# Altium schematic sheet Insole_ver1_chi.SchDoc
size 594 x 420 mm; SheetNumber: 1; SheetTotal: 1
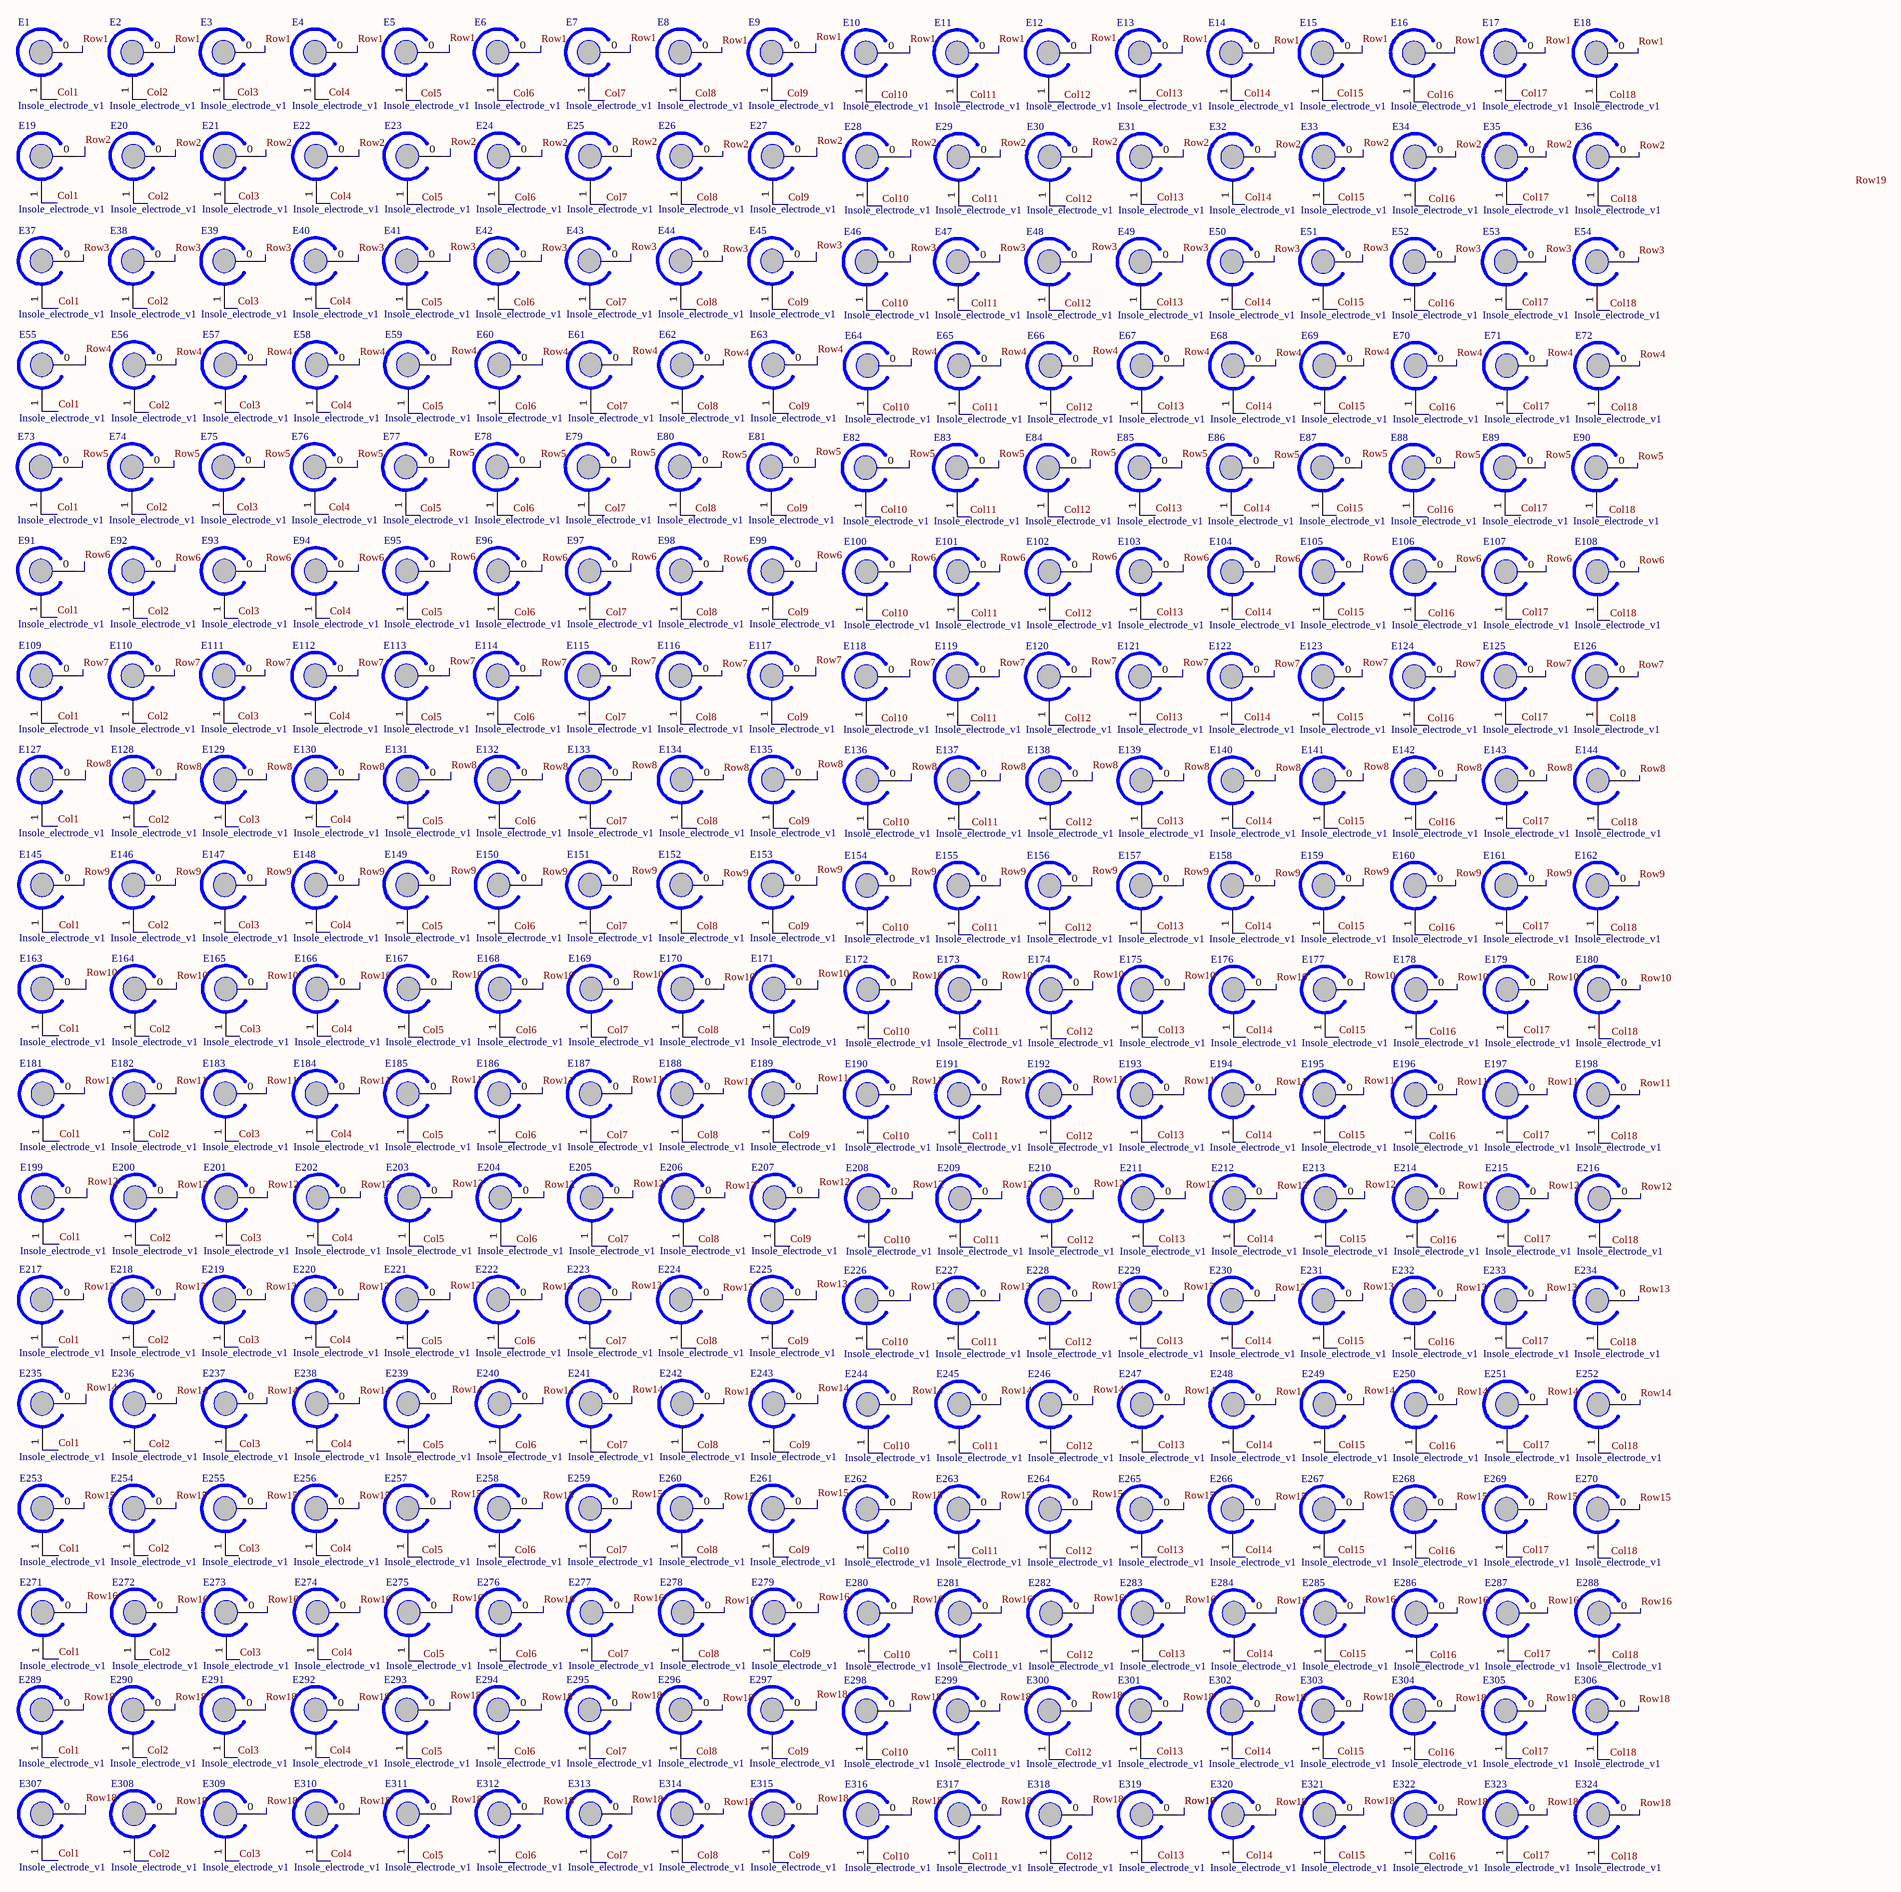
[diagram p0: Insole_ver1_chi.SchDoc]

## Parts
E1  Insole_electrode_v1  [insole_electrode_v1]
E2  Insole_electrode_v1  [insole_electrode_v1]
E3  Insole_electrode_v1  [insole_electrode_v1]
E4  Insole_electrode_v1  [insole_electrode_v1]
E5  Insole_electrode_v1  [insole_electrode_v1]
E6  Insole_electrode_v1  [insole_electrode_v1]
E7  Insole_electrode_v1  [insole_electrode_v1]
E8  Insole_electrode_v1  [insole_electrode_v1]
E9  Insole_electrode_v1  [insole_electrode_v1]
E10  Insole_electrode_v1  [insole_electrode_v1]
E11  Insole_electrode_v1  [insole_electrode_v1]
E12  Insole_electrode_v1  [insole_electrode_v1]
E13  Insole_electrode_v1  [insole_electrode_v1]
E14  Insole_electrode_v1  [insole_electrode_v1]
E15  Insole_electrode_v1  [insole_electrode_v1]
E16  Insole_electrode_v1  [insole_electrode_v1]
E17  Insole_electrode_v1  [insole_electrode_v1]
E18  Insole_electrode_v1  [insole_electrode_v1]
E19  Insole_electrode_v1  [insole_electrode_v1]
E20  Insole_electrode_v1  [insole_electrode_v1]
E21  Insole_electrode_v1  [insole_electrode_v1]
E22  Insole_electrode_v1  [insole_electrode_v1]
E23  Insole_electrode_v1  [insole_electrode_v1]
E24  Insole_electrode_v1  [insole_electrode_v1]
E25  Insole_electrode_v1  [insole_electrode_v1]
E26  Insole_electrode_v1  [insole_electrode_v1]
E27  Insole_electrode_v1  [insole_electrode_v1]
E28  Insole_electrode_v1  [insole_electrode_v1]
E29  Insole_electrode_v1  [insole_electrode_v1]
E30  Insole_electrode_v1  [insole_electrode_v1]
E31  Insole_electrode_v1  [insole_electrode_v1]
E32  Insole_electrode_v1  [insole_electrode_v1]
E33  Insole_electrode_v1  [insole_electrode_v1]
E34  Insole_electrode_v1  [insole_electrode_v1]
E35  Insole_electrode_v1  [insole_electrode_v1]
E36  Insole_electrode_v1  [insole_electrode_v1]
E37  Insole_electrode_v1  [insole_electrode_v1]
E38  Insole_electrode_v1  [insole_electrode_v1]
E39  Insole_electrode_v1  [insole_electrode_v1]
E40  Insole_electrode_v1  [insole_electrode_v1]
E41  Insole_electrode_v1  [insole_electrode_v1]
E42  Insole_electrode_v1  [insole_electrode_v1]
E43  Insole_electrode_v1  [insole_electrode_v1]
E44  Insole_electrode_v1  [insole_electrode_v1]
E45  Insole_electrode_v1  [insole_electrode_v1]
E46  Insole_electrode_v1  [insole_electrode_v1]
E47  Insole_electrode_v1  [insole_electrode_v1]
E48  Insole_electrode_v1  [insole_electrode_v1]
E49  Insole_electrode_v1  [insole_electrode_v1]
E50  Insole_electrode_v1  [insole_electrode_v1]
E51  Insole_electrode_v1  [insole_electrode_v1]
E52  Insole_electrode_v1  [insole_electrode_v1]
E53  Insole_electrode_v1  [insole_electrode_v1]
E54  Insole_electrode_v1  [insole_electrode_v1]
E55  Insole_electrode_v1  [insole_electrode_v1]
E56  Insole_electrode_v1  [insole_electrode_v1]
E57  Insole_electrode_v1  [insole_electrode_v1]
E58  Insole_electrode_v1  [insole_electrode_v1]
E59  Insole_electrode_v1  [insole_electrode_v1]
E60  Insole_electrode_v1  [insole_electrode_v1]
E61  Insole_electrode_v1  [insole_electrode_v1]
E62  Insole_electrode_v1  [insole_electrode_v1]
E63  Insole_electrode_v1  [insole_electrode_v1]
E64  Insole_electrode_v1  [insole_electrode_v1]
E65  Insole_electrode_v1  [insole_electrode_v1]
E66  Insole_electrode_v1  [insole_electrode_v1]
E67  Insole_electrode_v1  [insole_electrode_v1]
E68  Insole_electrode_v1  [insole_electrode_v1]
E69  Insole_electrode_v1  [insole_electrode_v1]
E70  Insole_electrode_v1  [insole_electrode_v1]
E71  Insole_electrode_v1  [insole_electrode_v1]
E72  Insole_electrode_v1  [insole_electrode_v1]
E73  Insole_electrode_v1  [insole_electrode_v1]
E74  Insole_electrode_v1  [insole_electrode_v1]
E75  Insole_electrode_v1  [insole_electrode_v1]
E76  Insole_electrode_v1  [insole_electrode_v1]
E77  Insole_electrode_v1  [insole_electrode_v1]
E78  Insole_electrode_v1  [insole_electrode_v1]
E79  Insole_electrode_v1  [insole_electrode_v1]
E80  Insole_electrode_v1  [insole_electrode_v1]
E81  Insole_electrode_v1  [insole_electrode_v1]
E82  Insole_electrode_v1  [insole_electrode_v1]
E83  Insole_electrode_v1  [insole_electrode_v1]
E84  Insole_electrode_v1  [insole_electrode_v1]
E85  Insole_electrode_v1  [insole_electrode_v1]
E86  Insole_electrode_v1  [insole_electrode_v1]
E87  Insole_electrode_v1  [insole_electrode_v1]
E88  Insole_electrode_v1  [insole_electrode_v1]
E89  Insole_electrode_v1  [insole_electrode_v1]
E90  Insole_electrode_v1  [insole_electrode_v1]
E91  Insole_electrode_v1  [insole_electrode_v1]
E92  Insole_electrode_v1  [insole_electrode_v1]
E93  Insole_electrode_v1  [insole_electrode_v1]
E94  Insole_electrode_v1  [insole_electrode_v1]
E95  Insole_electrode_v1  [insole_electrode_v1]
E96  Insole_electrode_v1  [insole_electrode_v1]
E97  Insole_electrode_v1  [insole_electrode_v1]
E98  Insole_electrode_v1  [insole_electrode_v1]
E99  Insole_electrode_v1  [insole_electrode_v1]
E100  Insole_electrode_v1  [insole_electrode_v1]
E101  Insole_electrode_v1  [insole_electrode_v1]
E102  Insole_electrode_v1  [insole_electrode_v1]
E103  Insole_electrode_v1  [insole_electrode_v1]
E104  Insole_electrode_v1  [insole_electrode_v1]
E105  Insole_electrode_v1  [insole_electrode_v1]
E106  Insole_electrode_v1  [insole_electrode_v1]
E107  Insole_electrode_v1  [insole_electrode_v1]
E108  Insole_electrode_v1  [insole_electrode_v1]
E109  Insole_electrode_v1  [insole_electrode_v1]
E110  Insole_electrode_v1  [insole_electrode_v1]
E111  Insole_electrode_v1  [insole_electrode_v1]
E112  Insole_electrode_v1  [insole_electrode_v1]
E113  Insole_electrode_v1  [insole_electrode_v1]
E114  Insole_electrode_v1  [insole_electrode_v1]
E115  Insole_electrode_v1  [insole_electrode_v1]
E116  Insole_electrode_v1  [insole_electrode_v1]
E117  Insole_electrode_v1  [insole_electrode_v1]
E118  Insole_electrode_v1  [insole_electrode_v1]
E119  Insole_electrode_v1  [insole_electrode_v1]
E120  Insole_electrode_v1  [insole_electrode_v1]
E121  Insole_electrode_v1  [insole_electrode_v1]
E122  Insole_electrode_v1  [insole_electrode_v1]
E123  Insole_electrode_v1  [insole_electrode_v1]
E124  Insole_electrode_v1  [insole_electrode_v1]
E125  Insole_electrode_v1  [insole_electrode_v1]
E126  Insole_electrode_v1  [insole_electrode_v1]
E127  Insole_electrode_v1  [insole_electrode_v1]
E128  Insole_electrode_v1  [insole_electrode_v1]
E129  Insole_electrode_v1  [insole_electrode_v1]
E130  Insole_electrode_v1  [insole_electrode_v1]
E131  Insole_electrode_v1  [insole_electrode_v1]
E132  Insole_electrode_v1  [insole_electrode_v1]
E133  Insole_electrode_v1  [insole_electrode_v1]
E134  Insole_electrode_v1  [insole_electrode_v1]
E135  Insole_electrode_v1  [insole_electrode_v1]
E136  Insole_electrode_v1  [insole_electrode_v1]
E137  Insole_electrode_v1  [insole_electrode_v1]
E138  Insole_electrode_v1  [insole_electrode_v1]
E139  Insole_electrode_v1  [insole_electrode_v1]
E140  Insole_electrode_v1  [insole_electrode_v1]
E141  Insole_electrode_v1  [insole_electrode_v1]
E142  Insole_electrode_v1  [insole_electrode_v1]
E143  Insole_electrode_v1  [insole_electrode_v1]
E144  Insole_electrode_v1  [insole_electrode_v1]
E145  Insole_electrode_v1  [insole_electrode_v1]
E146  Insole_electrode_v1  [insole_electrode_v1]
E147  Insole_electrode_v1  [insole_electrode_v1]
E148  Insole_electrode_v1  [insole_electrode_v1]
E149  Insole_electrode_v1  [insole_electrode_v1]
E150  Insole_electrode_v1  [insole_electrode_v1]
E151  Insole_electrode_v1  [insole_electrode_v1]
E152  Insole_electrode_v1  [insole_electrode_v1]
E153  Insole_electrode_v1  [insole_electrode_v1]
E154  Insole_electrode_v1  [insole_electrode_v1]
E155  Insole_electrode_v1  [insole_electrode_v1]
E156  Insole_electrode_v1  [insole_electrode_v1]
E157  Insole_electrode_v1  [insole_electrode_v1]
E158  Insole_electrode_v1  [insole_electrode_v1]
E159  Insole_electrode_v1  [insole_electrode_v1]
E160  Insole_electrode_v1  [insole_electrode_v1]
E161  Insole_electrode_v1  [insole_electrode_v1]
E162  Insole_electrode_v1  [insole_electrode_v1]
E163  Insole_electrode_v1  [insole_electrode_v1]
E164  Insole_electrode_v1  [insole_electrode_v1]
E165  Insole_electrode_v1  [insole_electrode_v1]
E166  Insole_electrode_v1  [insole_electrode_v1]
E167  Insole_electrode_v1  [insole_electrode_v1]
E168  Insole_electrode_v1  [insole_electrode_v1]
E169  Insole_electrode_v1  [insole_electrode_v1]
E170  Insole_electrode_v1  [insole_electrode_v1]
E171  Insole_electrode_v1  [insole_electrode_v1]
E172  Insole_electrode_v1  [insole_electrode_v1]
E173  Insole_electrode_v1  [insole_electrode_v1]
E174  Insole_electrode_v1  [insole_electrode_v1]
E175  Insole_electrode_v1  [insole_electrode_v1]
E176  Insole_electrode_v1  [insole_electrode_v1]
E177  Insole_electrode_v1  [insole_electrode_v1]
E178  Insole_electrode_v1  [insole_electrode_v1]
E179  Insole_electrode_v1  [insole_electrode_v1]
E180  Insole_electrode_v1  [insole_electrode_v1]
E181  Insole_electrode_v1  [insole_electrode_v1]
E182  Insole_electrode_v1  [insole_electrode_v1]
E183  Insole_electrode_v1  [insole_electrode_v1]
E184  Insole_electrode_v1  [insole_electrode_v1]
E185  Insole_electrode_v1  [insole_electrode_v1]
E186  Insole_electrode_v1  [insole_electrode_v1]
E187  Insole_electrode_v1  [insole_electrode_v1]
E188  Insole_electrode_v1  [insole_electrode_v1]
E189  Insole_electrode_v1  [insole_electrode_v1]
E190  Insole_electrode_v1  [insole_electrode_v1]
E191  Insole_electrode_v1  [insole_electrode_v1]
E192  Insole_electrode_v1  [insole_electrode_v1]
E193  Insole_electrode_v1  [insole_electrode_v1]
E194  Insole_electrode_v1  [insole_electrode_v1]
E195  Insole_electrode_v1  [insole_electrode_v1]
E196  Insole_electrode_v1  [insole_electrode_v1]
E197  Insole_electrode_v1  [insole_electrode_v1]
E198  Insole_electrode_v1  [insole_electrode_v1]
E199  Insole_electrode_v1  [insole_electrode_v1]
E200  Insole_electrode_v1  [insole_electrode_v1]
E201  Insole_electrode_v1  [insole_electrode_v1]
E202  Insole_electrode_v1  [insole_electrode_v1]
E203  Insole_electrode_v1  [insole_electrode_v1]
E204  Insole_electrode_v1  [insole_electrode_v1]
E205  Insole_electrode_v1  [insole_electrode_v1]
E206  Insole_electrode_v1  [insole_electrode_v1]
E207  Insole_electrode_v1  [insole_electrode_v1]
E208  Insole_electrode_v1  [insole_electrode_v1]
E209  Insole_electrode_v1  [insole_electrode_v1]
E210  Insole_electrode_v1  [insole_electrode_v1]
E211  Insole_electrode_v1  [insole_electrode_v1]
E212  Insole_electrode_v1  [insole_electrode_v1]
E213  Insole_electrode_v1  [insole_electrode_v1]
E214  Insole_electrode_v1  [insole_electrode_v1]
E215  Insole_electrode_v1  [insole_electrode_v1]
E216  Insole_electrode_v1  [insole_electrode_v1]
E217  Insole_electrode_v1  [insole_electrode_v1]
E218  Insole_electrode_v1  [insole_electrode_v1]
E219  Insole_electrode_v1  [insole_electrode_v1]
E220  Insole_electrode_v1  [insole_electrode_v1]
E221  Insole_electrode_v1  [insole_electrode_v1]
E222  Insole_electrode_v1  [insole_electrode_v1]
E223  Insole_electrode_v1  [insole_electrode_v1]
E224  Insole_electrode_v1  [insole_electrode_v1]
E225  Insole_electrode_v1  [insole_electrode_v1]
E226  Insole_electrode_v1  [insole_electrode_v1]
E227  Insole_electrode_v1  [insole_electrode_v1]
E228  Insole_electrode_v1  [insole_electrode_v1]
E229  Insole_electrode_v1  [insole_electrode_v1]
E230  Insole_electrode_v1  [insole_electrode_v1]
E231  Insole_electrode_v1  [insole_electrode_v1]
E232  Insole_electrode_v1  [insole_electrode_v1]
E233  Insole_electrode_v1  [insole_electrode_v1]
E234  Insole_electrode_v1  [insole_electrode_v1]
E235  Insole_electrode_v1  [insole_electrode_v1]
E236  Insole_electrode_v1  [insole_electrode_v1]
E237  Insole_electrode_v1  [insole_electrode_v1]
E238  Insole_electrode_v1  [insole_electrode_v1]
E239  Insole_electrode_v1  [insole_electrode_v1]
E240  Insole_electrode_v1  [insole_electrode_v1]
E241  Insole_electrode_v1  [insole_electrode_v1]
E242  Insole_electrode_v1  [insole_electrode_v1]
E243  Insole_electrode_v1  [insole_electrode_v1]
E244  Insole_electrode_v1  [insole_electrode_v1]
E245  Insole_electrode_v1  [insole_electrode_v1]
E246  Insole_electrode_v1  [insole_electrode_v1]
E247  Insole_electrode_v1  [insole_electrode_v1]
E248  Insole_electrode_v1  [insole_electrode_v1]
E249  Insole_electrode_v1  [insole_electrode_v1]
E250  Insole_electrode_v1  [insole_electrode_v1]
E251  Insole_electrode_v1  [insole_electrode_v1]
E252  Insole_electrode_v1  [insole_electrode_v1]
E253  Insole_electrode_v1  [insole_electrode_v1]
E254  Insole_electrode_v1  [insole_electrode_v1]
E255  Insole_electrode_v1  [insole_electrode_v1]
E256  Insole_electrode_v1  [insole_electrode_v1]
E257  Insole_electrode_v1  [insole_electrode_v1]
E258  Insole_electrode_v1  [insole_electrode_v1]
E259  Insole_electrode_v1  [insole_electrode_v1]
E260  Insole_electrode_v1  [insole_electrode_v1]
E261  Insole_electrode_v1  [insole_electrode_v1]
E262  Insole_electrode_v1  [insole_electrode_v1]
E263  Insole_electrode_v1  [insole_electrode_v1]
E264  Insole_electrode_v1  [insole_electrode_v1]
E265  Insole_electrode_v1  [insole_electrode_v1]
E266  Insole_electrode_v1  [insole_electrode_v1]
E267  Insole_electrode_v1  [insole_electrode_v1]
E268  Insole_electrode_v1  [insole_electrode_v1]
E269  Insole_electrode_v1  [insole_electrode_v1]
E270  Insole_electrode_v1  [insole_electrode_v1]
E271  Insole_electrode_v1  [insole_electrode_v1]
E272  Insole_electrode_v1  [insole_electrode_v1]
E273  Insole_electrode_v1  [insole_electrode_v1]
E274  Insole_electrode_v1  [insole_electrode_v1]
E275  Insole_electrode_v1  [insole_electrode_v1]
E276  Insole_electrode_v1  [insole_electrode_v1]
E277  Insole_electrode_v1  [insole_electrode_v1]
E278  Insole_electrode_v1  [insole_electrode_v1]
E279  Insole_electrode_v1  [insole_electrode_v1]
E280  Insole_electrode_v1  [insole_electrode_v1]
E281  Insole_electrode_v1  [insole_electrode_v1]
E282  Insole_electrode_v1  [insole_electrode_v1]
E283  Insole_electrode_v1  [insole_electrode_v1]
E284  Insole_electrode_v1  [insole_electrode_v1]
E285  Insole_electrode_v1  [insole_electrode_v1]
E286  Insole_electrode_v1  [insole_electrode_v1]
E287  Insole_electrode_v1  [insole_electrode_v1]
E288  Insole_electrode_v1  [insole_electrode_v1]
E289  Insole_electrode_v1  [insole_electrode_v1]
E290  Insole_electrode_v1  [insole_electrode_v1]
E291  Insole_electrode_v1  [insole_electrode_v1]
E292  Insole_electrode_v1  [insole_electrode_v1]
E293  Insole_electrode_v1  [insole_electrode_v1]
E294  Insole_electrode_v1  [insole_electrode_v1]
E295  Insole_electrode_v1  [insole_electrode_v1]
E296  Insole_electrode_v1  [insole_electrode_v1]
E297  Insole_electrode_v1  [insole_electrode_v1]
E298  Insole_electrode_v1  [insole_electrode_v1]
E299  Insole_electrode_v1  [insole_electrode_v1]
E300  Insole_electrode_v1  [insole_electrode_v1]
E301  Insole_electrode_v1  [insole_electrode_v1]
E302  Insole_electrode_v1  [insole_electrode_v1]
E303  Insole_electrode_v1  [insole_electrode_v1]
E304  Insole_electrode_v1  [insole_electrode_v1]
E305  Insole_electrode_v1  [insole_electrode_v1]
E306  Insole_electrode_v1  [insole_electrode_v1]
E307  Insole_electrode_v1  [insole_electrode_v1]
E308  Insole_electrode_v1  [insole_electrode_v1]
E309  Insole_electrode_v1  [insole_electrode_v1]
E310  Insole_electrode_v1  [insole_electrode_v1]
E311  Insole_electrode_v1  [insole_electrode_v1]
E312  Insole_electrode_v1  [insole_electrode_v1]
E313  Insole_electrode_v1  [insole_electrode_v1]
E314  Insole_electrode_v1  [insole_electrode_v1]
E315  Insole_electrode_v1  [insole_electrode_v1]
E316  Insole_electrode_v1  [insole_electrode_v1]
E317  Insole_electrode_v1  [insole_electrode_v1]
E318  Insole_electrode_v1  [insole_electrode_v1]
E319  Insole_electrode_v1  [insole_electrode_v1]
E320  Insole_electrode_v1  [insole_electrode_v1]
E321  Insole_electrode_v1  [insole_electrode_v1]
E322  Insole_electrode_v1  [insole_electrode_v1]
E323  Insole_electrode_v1  [insole_electrode_v1]
E324  Insole_electrode_v1  [insole_electrode_v1]

## Nets
Col1: E1.1 E19.1 E37.1 E55.1 E73.1 E91.1 E109.1 E127.1 E145.1 E163.1 E181.1 E199.1 E217.1 E235.1 E253.1 E271.1 E289.1 E307.1
Col2: E2.1 E20.1 E38.1 E56.1 E74.1 E92.1 E110.1 E128.1 E146.1 E164.1 E182.1 E200.1 E218.1 E236.1 E254.1 E272.1 E290.1 E308.1
Col3: E3.1 E21.1 E39.1 E57.1 E75.1 E93.1 E111.1 E129.1 E147.1 E165.1 E183.1 E201.1 E219.1 E237.1 E255.1 E273.1 E291.1 E309.1
Col4: E4.1 E22.1 E40.1 E58.1 E76.1 E94.1 E112.1 E130.1 E148.1 E166.1 E184.1 E202.1 E220.1 E238.1 E256.1 E274.1 E292.1 E310.1
Col5: E5.1 E23.1 E41.1 E59.1 E77.1 E95.1 E113.1 E131.1 E149.1 E167.1 E185.1 E203.1 E221.1 E239.1 E257.1 E275.1 E293.1 E311.1
Col6: E6.1 E24.1 E42.1 E60.1 E78.1 E96.1 E114.1 E132.1 E150.1 E168.1 E186.1 E204.1 E222.1 E240.1 E258.1 E276.1 E294.1 E312.1
Col7: E7.1 E25.1 E43.1 E61.1 E79.1 E97.1 E115.1 E133.1 E151.1 E169.1 E187.1 E205.1 E223.1 E241.1 E259.1 E277.1 E295.1 E313.1
Col8: E8.1 E26.1 E44.1 E62.1 E80.1 E98.1 E116.1 E134.1 E152.1 E170.1 E188.1 E206.1 E224.1 E242.1 E260.1 E278.1 E296.1 E314.1
Col9: E9.1 E27.1 E45.1 E63.1 E81.1 E99.1 E117.1 E135.1 E153.1 E171.1 E189.1 E207.1 E225.1 E243.1 E261.1 E279.1 E297.1 E315.1
Col10: E10.1 E28.1 E46.1 E64.1 E82.1 E100.1 E118.1 E136.1 E154.1 E172.1 E190.1 E208.1 E226.1 E244.1 E262.1 E280.1 E298.1 E316.1
Col11: E11.1 E29.1 E47.1 E65.1 E83.1 E101.1 E119.1 E137.1 E155.1 E173.1 E191.1 E209.1 E227.1 E245.1 E263.1 E281.1 E299.1 E317.1
Col12: E12.1 E30.1 E48.1 E66.1 E84.1 E102.1 E120.1 E138.1 E156.1 E174.1 E192.1 E210.1 E228.1 E246.1 E264.1 E282.1 E300.1 E318.1
Col13: E13.1 E31.1 E49.1 E67.1 E85.1 E103.1 E121.1 E139.1 E157.1 E175.1 E193.1 E211.1 E229.1 E247.1 E265.1 E283.1 E301.1 E319.1
Col14: E14.1 E32.1 E50.1 E68.1 E86.1 E104.1 E122.1 E140.1 E158.1 E176.1 E194.1 E212.1 E230.1 E248.1 E266.1 E284.1 E302.1 E320.1
Col15: E15.1 E33.1 E51.1 E69.1 E87.1 E105.1 E123.1 E141.1 E159.1 E177.1 E195.1 E213.1 E231.1 E249.1 E267.1 E285.1 E303.1 E321.1
Col16: E16.1 E34.1 E52.1 E70.1 E88.1 E106.1 E124.1 E142.1 E160.1 E178.1 E196.1 E214.1 E232.1 E250.1 E268.1 E286.1 E304.1 E322.1
Col17: E17.1 E35.1 E53.1 E71.1 E89.1 E107.1 E125.1 E143.1 E161.1 E179.1 E197.1 E215.1 E233.1 E251.1 E269.1 E287.1 E305.1 E323.1
Col18: E18.1 E36.1 E54.1 E72.1 E90.1 E108.1 E126.1 E144.1 E162.1 E180.1 E198.1 E216.1 E234.1 E252.1 E270.1 E288.1 E306.1 E324.1
Row1: E1.0 E2.0 E3.0 E4.0 E5.0 E6.0 E7.0 E8.0 E9.0 E10.0 E11.0 E12.0 E13.0 E14.0 E15.0 E16.0 E17.0 E18.0
Row2: E19.0 E20.0 E21.0 E22.0 E23.0 E24.0 E25.0 E26.0 E27.0 E28.0 E29.0 E30.0 E31.0 E32.0 E33.0 E34.0 E35.0 E36.0
Row3: E37.0 E38.0 E39.0 E40.0 E41.0 E42.0 E43.0 E44.0 E45.0 E46.0 E47.0 E48.0 E49.0 E50.0 E51.0 E52.0 E53.0 E54.0
Row4: E55.0 E56.0 E57.0 E58.0 E59.0 E60.0 E61.0 E62.0 E63.0 E64.0 E65.0 E66.0 E67.0 E68.0 E69.0 E70.0 E71.0 E72.0
Row5: E73.0 E74.0 E75.0 E76.0 E77.0 E78.0 E79.0 E80.0 E81.0 E82.0 E83.0 E84.0 E85.0 E86.0 E87.0 E88.0 E89.0 E90.0
Row6: E91.0 E92.0 E93.0 E94.0 E95.0 E96.0 E97.0 E98.0 E99.0 E100.0 E101.0 E102.0 E103.0 E104.0 E105.0 E106.0 E107.0 E108.0
Row7: E109.0 E110.0 E111.0 E112.0 E113.0 E114.0 E115.0 E116.0 E117.0 E118.0 E119.0 E120.0 E121.0 E122.0 E123.0 E124.0 E125.0 E126.0
Row8: E127.0 E128.0 E129.0 E130.0 E131.0 E132.0 E133.0 E134.0 E135.0 E136.0 E137.0 E138.0 E139.0 E140.0 E141.0 E142.0 E143.0 E144.0
Row9: E145.0 E146.0 E147.0 E148.0 E149.0 E150.0 E151.0 E152.0 E153.0 E154.0 E155.0 E156.0 E157.0 E158.0 E159.0 E160.0 E161.0 E162.0
Row10: E163.0 E164.0 E165.0 E166.0 E167.0 E168.0 E169.0 E170.0 E171.0 E172.0 E173.0 E174.0 E175.0 E176.0 E177.0 E178.0 E179.0 E180.0
Row11: E181.0 E182.0 E183.0 E184.0 E185.0 E186.0 E187.0 E188.0 E189.0 E190.0 E191.0 E192.0 E193.0 E194.0 E195.0 E196.0 E197.0 E198.0
Row12: E199.0 E200.0 E201.0 E202.0 E203.0 E204.0 E205.0 E206.0 E207.0 E208.0 E209.0 E210.0 E211.0 E212.0 E213.0 E214.0 E215.0 E216.0
Row13: E217.0 E218.0 E219.0 E220.0 E221.0 E222.0 E223.0 E224.0 E225.0 E226.0 E227.0 E228.0 E229.0 E230.0 E231.0 E232.0 E233.0 E234.0
Row14: E235.0 E236.0 E237.0 E238.0 E239.0 E240.0 E241.0 E242.0 E243.0 E244.0 E245.0 E246.0 E247.0 E248.0 E249.0 E250.0 E251.0 E252.0
Row15: E253.0 E254.0 E255.0 E256.0 E257.0 E258.0 E259.0 E260.0 E261.0 E262.0 E263.0 E264.0 E265.0 E266.0 E267.0 E268.0 E269.0 E270.0
Row16: E271.0 E272.0 E273.0 E274.0 E275.0 E276.0 E277.0 E278.0 E279.0 E280.0 E281.0 E282.0 E283.0 E284.0 E285.0 E286.0 E287.0 E288.0 E289.0 E290.0 E291.0 E292.0 E293.0 E294.0 E295.0 E296.0 E297.0 E298.0 E299.0 E300.0 E301.0 E302.0 E303.0 E304.0 E305.0 E306.0 E307.0 E308.0 E309.0 E310.0 E311.0 E312.0 E313.0 E314.0 E315.0 E316.0 E317.0 E318.0 E319.0 E320.0 E321.0 E322.0 E323.0 E324.0  [also labelled Row18]

## Notes on the sheet
- Labels drawn without touching a wire or pin: Row19
- DWG NO:
- REV:
- THIS DOCUMENT AND THE DATA DISCLOSED HEREIN OR
- HEREWITH IS THE PROPERTY OF ALTIUM LIMITED AND MAY
- BE FREELY DISTRIBUTED IN WHOLE. NO RIGHTS ARE
- RESERVED OR EXPRESS OR IMPLIED WARANTEE GIVEN.
- REVISION
- DESCRIPTION
- DATE
- APPROVED
- ENG:
- APPROVALS
- PROJECT
- DSN:
- CHK:
- REFERENCE DOCUMENTS
- PROJECT REVISION:
- TITLE
- DOCUMENT REVISION:
- DESIGN ITEM:
- BOM:
- FAB DWG:
- PCB DWG:
- ASSY DWG:
- SCALE:
- A2
- SIZE
- CAGE CODE
- FILE NAME
- DWG NO.
- SHEET
- OF
- REV

## Library data of the parts
E1-E324 = CMP-065-000001-1: Source: Sheet1_sensor_mat_inso_v1 1.SCHLIB; Component Type: Standard; Design Item ID: Insole_electrode_v1; Pin Count: 2